# EAGLE design RaspberryPi-PICPgm (EAGLE 7.2.0)
PIC Programmer using Raspberry Pi GPIOs http://holdenc.altervista.org/rpp/ http://holdenc.altervista.org/rpp/downloads/rpp010.tgz http://www.techmeology.co.uk/rpipic/rpipic-2012100701.tar.gz http://mujweb.cz/tlc/rpp/ https://github.com/oh7bf/PiPIC/tree/master/RaspiPICprog http://www.techmeology.co.uk/rpipic/
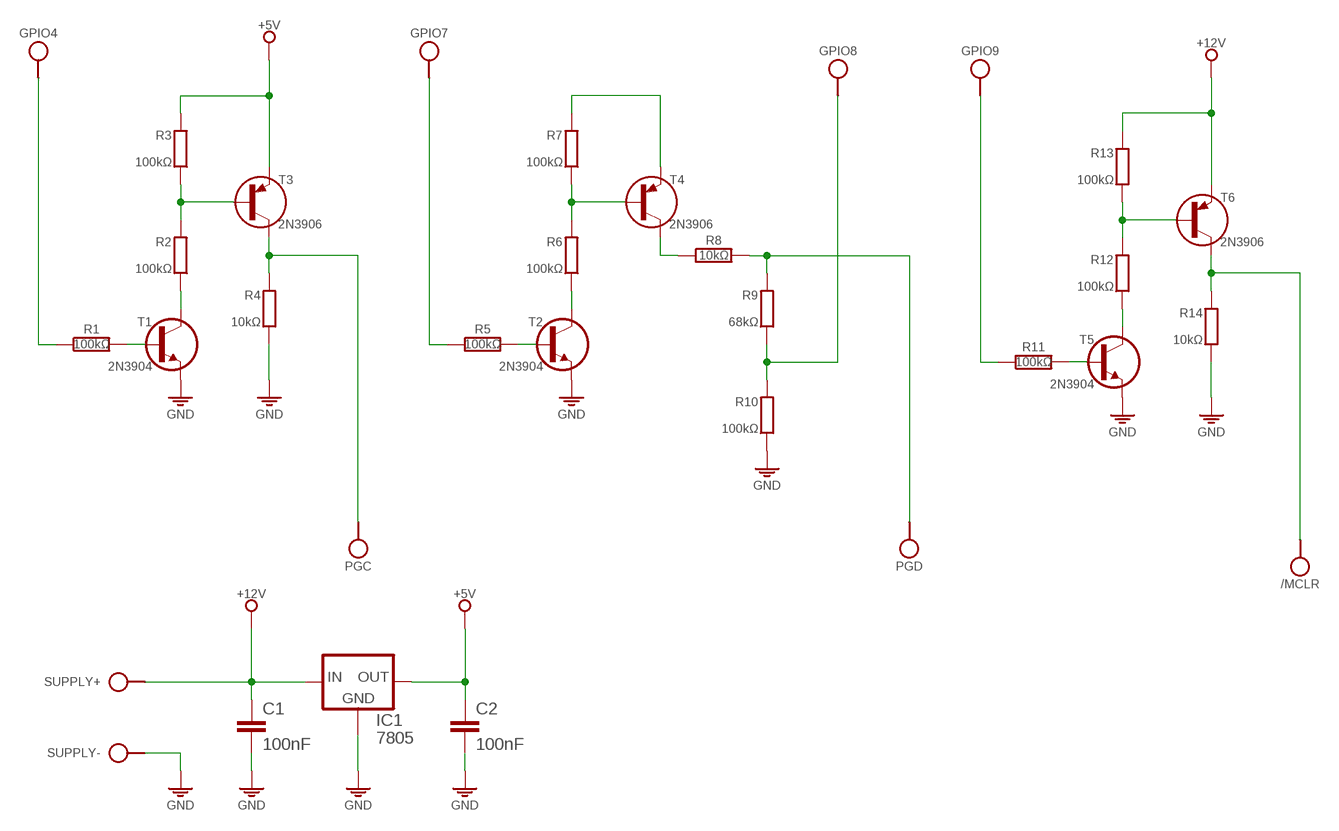
[diagram p0: schematic, sheet 1]

## Parts
/MCLR  VPORT  [SPAD]
C1  100nF  C050-025X075  [C050-025X075]
C2  100nF  C050-025X075  [C050-025X075]
GPIO4  VPORT  [SPAD]
GPIO7  VPORT  [SPAD]
GPIO8  VPORT  [SPAD]
GPIO9  VPORT  [SPAD]
IC1  7805  LM78  [TO220]
PGC  VPORT  [SPAD]
PGD  VPORT  [SPAD]
R1  100kΩ  R-H0204/10  [0204/10]
R2  100kΩ  R0204/10-V  [0204/10-V]
R3  100kΩ  R0204/10-V  [0204/10-V]
R4  10kΩ  R0204/10-V  [0204/10-V]
R5  100kΩ  R-H0204/10  [0204/10]
R6  100kΩ  R0204/10-V  [0204/10-V]
R7  100kΩ  R0204/10-V  [0204/10-V]
R8  10kΩ  R-H0204/10  [0204/10]
R9  68kΩ  R0204/10-V  [0204/10-V]
R10  100kΩ  R0204/10-V  [0204/10-V]
R11  100kΩ  R-H0204/10  [0204/10]
R12  100kΩ  R0204/10-V  [0204/10-V]
R13  100kΩ  R0204/10-V  [0204/10-V]
R14  10kΩ  R0204/10-V  [0204/10-V]
SUPPLY  SPAD+--+  [SPAD-+]
T1  2N3904  [TO92]
T2  2N3904  [TO92]
T3  2N3906  [TO92]
T4  2N3906  [TO92]
T5  2N3904  [TO92]
T6  2N3906  [TO92]

## Nets
+5V: C2.1 IC1.3(OUT) R3.1 R7.1 T3.1(E) T4.1(E)
+12V: C1.1 IC1.1(IN) R13.1 SUPPLY.2 T6.1(E)
/MCLR: /MCLR.1 R14.1 T6.3(C)
GND: C1.2 C2.2 IC1.2(GND) R4.2 R10.2 R14.2 SUPPLY.1 T1.1(E) T2.1(E) T5.1(E)
GPIO4: GPIO4.1 R1.1
GPIO7: GPIO7.1 R5.1
GPIO8: GPIO8.1 R9.2 R10.1
GPIO9: GPIO9.1 R11.1
N$2: R1.2 T1.2(B)
N$3: R2.2 T1.3(C)
N$4: R2.1 R3.2 T3.2(B)
N$7: R5.2 T2.2(B)
N$8: R6.2 T2.3(C)
N$9: R6.1 R7.2 T4.2(B)
N$10: R8.1 T4.3(C)
N$14: R11.2 T5.2(B)
N$15: R12.2 T5.3(C)
N$16: R12.1 R13.2 T6.2(B)
PGC: PGC.1 R4.1 T3.3(C)
PGD: PGD.1 R8.2 R9.1

## Library data of the parts
/MCLR GPIO4 GPIO7-GPIO9 PGC PGD = pad:VPORT
C1 C2 = c:C: CAPACITOR, European symbol
IC1 = ic:LM78*
R1 R5 R8 R11 = r:R-H
R2-R4 R6 R7 R9 R10 R12-R14 = r:R: RESISTOR, European symbol
SUPPLY = pad:SPAD+-
T1 T2 T5 = t:2N3904
T3 T4 T6 = t:2N3906

## Board
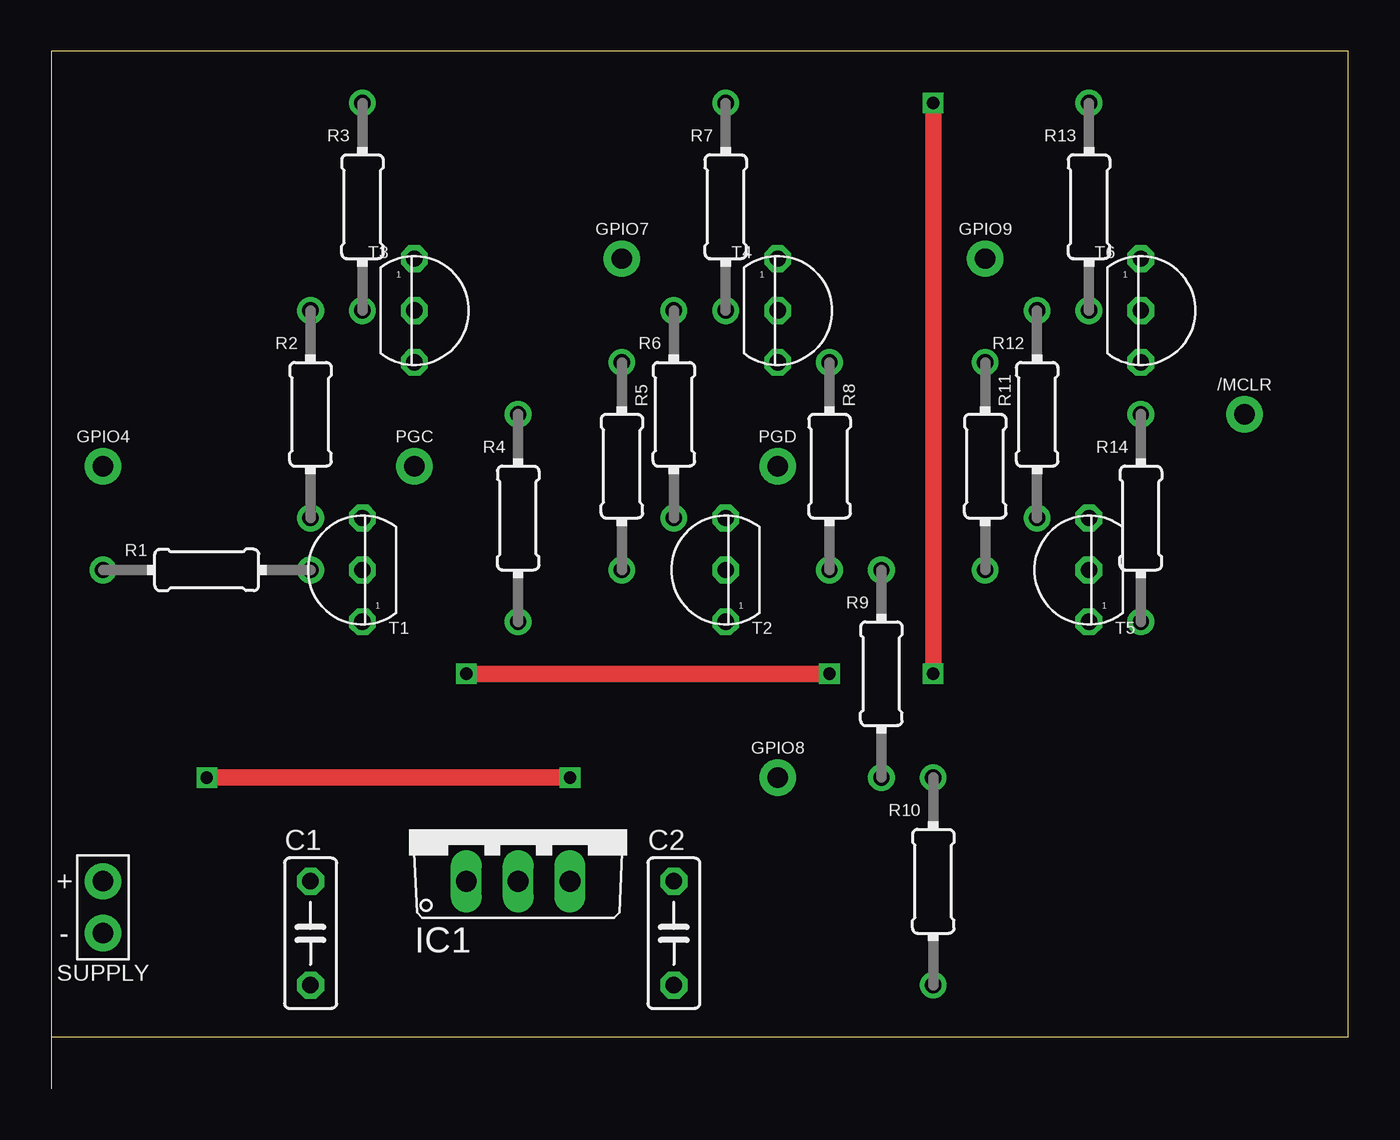
[diagram p1: board, top side]
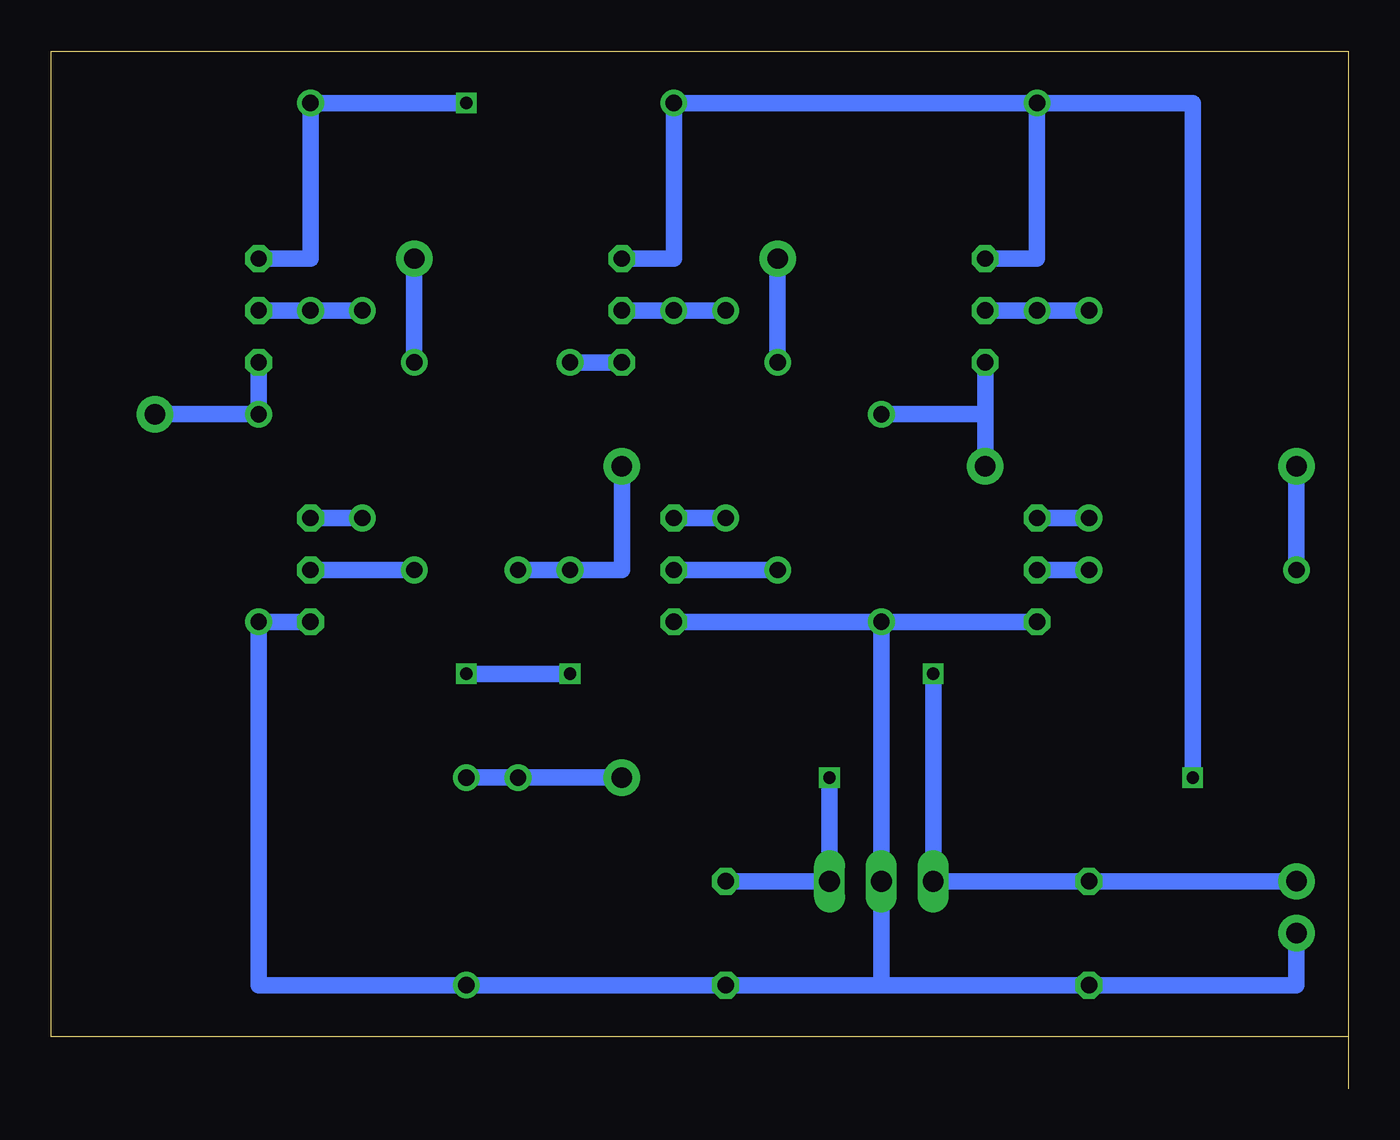
[diagram p2: board, bottom side, seen from below]

Size 63.5 x 50.8 mm. Coordinates in mm from the lower left corner, seen from the top.
Outline: 0,2.54 63.5,2.54 63.5,50.8 0,50.8 0,2.54
Outline: 0,2.54 0,0
Copper layers (1*16): Top 0.035mm / dielectric 1.5mm / Bottom 0.035mm
Design rules "default": minimum track width 10mil, minimum drill 24mil, track to track 8mil, track to pad 8mil, pad to pad 8mil, via to via 8mil, smd to smd 8mil, copper to edge 40mil, drill to drill 8mil, minimum pad ring 10mil, minimum via ring 8mil, stop-mask expansion 4mil, vias tented up to drill 0mil, thermal gap 10mil

### Footprints (pad centres in the part's own frame; a part is rotated, then mirrored left to right if it is on the bottom)
SPAD = drill 1 pad 1.778: 1 0,0
C050-025X075 = drill 0.813 octagon: 1 2.54,0; 2 -2.54,0
TO220 = drill 1.016 long: 1 -2.54,-2.54; 2 0,-2.54; 3 2.54,-2.54
0204/10 = drill 0.8: 1 -5.08,0; 2 5.08,0
0204/10-V = drill 0.8: 1 0,5.08; 2 0,-5.08
SPAD-+ = drill 1 pad 1.778: 1 0,-1.27; 2 0,1.27
TO92 = drill 0.8 octagon: 1 0,2.54; 2 0,0; 3 0,-2.54

### Placement (x,y rotation side)
/MCLR  58.42,33.02 270 top
C1  12.7,7.62 90 top
C2  30.48,7.62 90 top
GPIO4  2.54,30.48 270 top
GPIO7  27.94,40.64 270 top
GPIO8  35.56,15.24 270 top
GPIO9  45.72,40.64 270 top
IC1  22.86,12.7 0 top
PGC  17.78,30.48 270 top
PGD  35.56,30.48 270 top
R1  7.62,25.4 0 top
R2  12.7,33.02 0 top
R3  15.24,43.18 0 top
R4  22.86,27.94 0 top
R5  27.94,30.48 270 top
R6  30.48,33.02 0 top
R7  33.02,43.18 0 top
R8  38.1,30.48 270 top
R9  40.64,20.32 0 top
R10  43.18,10.16 0 top
R11  45.72,30.48 270 top
R12  48.26,33.02 0 top
R13  50.8,43.18 0 top
R14  53.34,27.94 0 top
SUPPLY  2.54,8.89 0 top
T1  15.24,25.4 180 top
T2  33.02,25.4 180 top
T3  17.78,38.1 0 top
T4  35.56,38.1 0 top
T5  50.8,25.4 180 top
T6  53.34,38.1 0 top

### Tracks (layer width: path | path; a pad name or v marks a point on that pad's centre or on a via)
+5V  (via drill 0.6)
  Top 0.813: v25.4,15.24 v7.62,15.24
  Bottom 0.813: T4.1 33.02,40.64 R7.1 R3.1 | R3.1 15.24,40.64 T3.1 | C2.1 IC1.3 v25.4,15.24 | v7.62,15.24 7.62,48.26 R3.1
+12V  (via drill 0.6)
  Top 0.813: v20.32,20.32 v38.1,20.32 | v43.18,20.32 v43.18,48.26
  Bottom 0.813: T6.1 50.8,40.64 R13.1 v43.18,48.26 | IC1.1 C1.1 SUPPLY.2 IC1.1 | IC1.1 v20.32,20.32 | v38.1,20.32 v43.18,20.32
/MCLR
  Bottom 0.813: T6.3 R14.1 /MCLR.1
GND
  Bottom 0.813: T5.1 R14.2 53.34,5.08 R10.2 | 21.59,5.08 C1.2 2.54,5.08 SUPPLY.1 | 21.59,5.08 C2.2 R10.2 | 21.59,5.08 22.86,5.08 IC1.2 R4.2 | 45.72,5.08 R10.2 | T1.1 R4.2 | R4.2 T2.1
GPIO4
  Bottom 0.813: GPIO4.1 R1.1
GPIO7
  Bottom 0.813: GPIO7.1 R5.1
GPIO8
  Bottom 0.813: R10.1 R9.2 GPIO8.1
GPIO9
  Bottom 0.813: R11.1 GPIO9.1
N$2
  Bottom 0.813: T1.2 R1.2
N$3
  Bottom 0.813: T1.3 R2.2
N$4
  Bottom 0.813: R3.2 R2.1 T3.2
N$7
  Bottom 0.813: T2.2 R5.2
N$8
  Bottom 0.813: T2.3 R6.2
N$9
  Bottom 0.813: R7.2 R6.1 T4.2
N$10
  Bottom 0.813: R8.1 T4.3
N$14
  Bottom 0.813: T5.2 R11.2
N$15
  Bottom 0.813: T5.3 R12.2
N$16
  Bottom 0.813: T6.2 R12.1 R13.2
PGC
  Bottom 0.813: PGC.1 17.78,33.02 | 17.78,33.02 T3.3 | R4.1 17.78,33.02
PGD
  Bottom 0.813: R9.1 R8.2 35.56,25.4 PGD.1

### Text on the board
Measures: 18 | 15 | 10 | 9 | 8 | 7 | 6 | 5 | 4 | 3 | 2 | 1 | 1 | 5 | 10 | 15 | 20 | 24